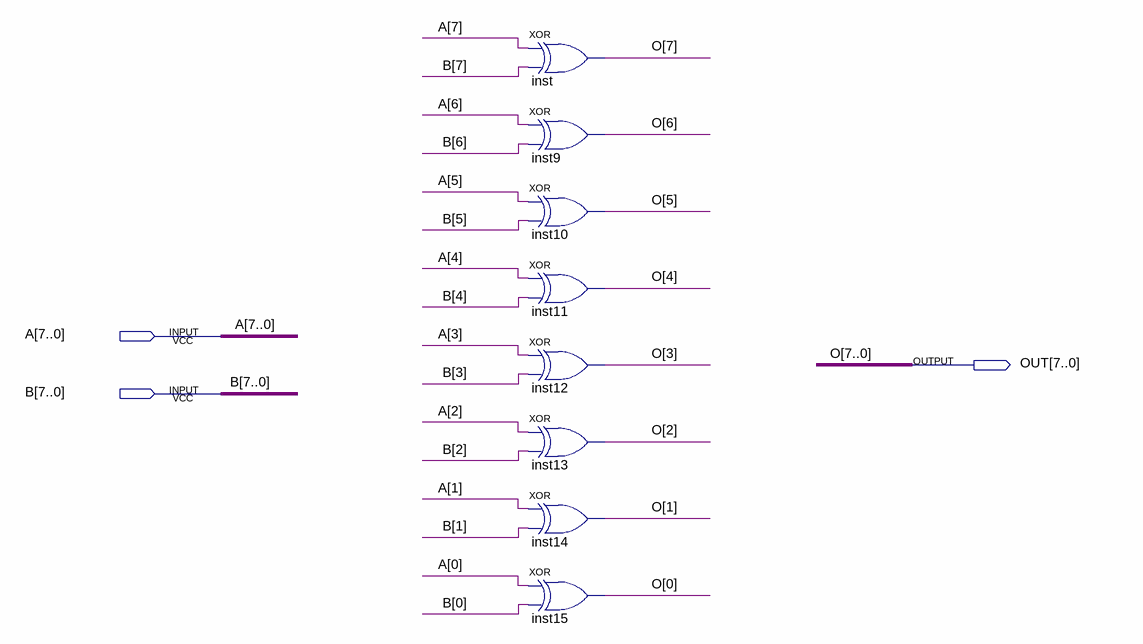
[diagram p0: schematic sheet]
// Quartus schematic XOR_8BIT.bdf as structural Verilog: 8 symbols, 3 pins
module XOR_8BIT (
  input  [7:0] A,
  input  [7:0] B,
  output [7:0] OUT
);

  xor inst (OUT[7], A[7], B[7]);
  xor inst9 (OUT[6], A[6], B[6]);
  xor inst10 (OUT[5], A[5], B[5]);
  xor inst11 (OUT[4], A[4], B[4]);
  xor inst12 (OUT[3], A[3], B[3]);
  xor inst13 (OUT[2], A[2], B[2]);
  xor inst14 (OUT[1], A[1], B[1]);
  xor inst15 (OUT[0], A[0], B[0]);

  // Other names for the same wires on the sheet: O[7:0] = OUT
endmodule
